# EAGLE design GPS-module (EAGLE 8.3.1)
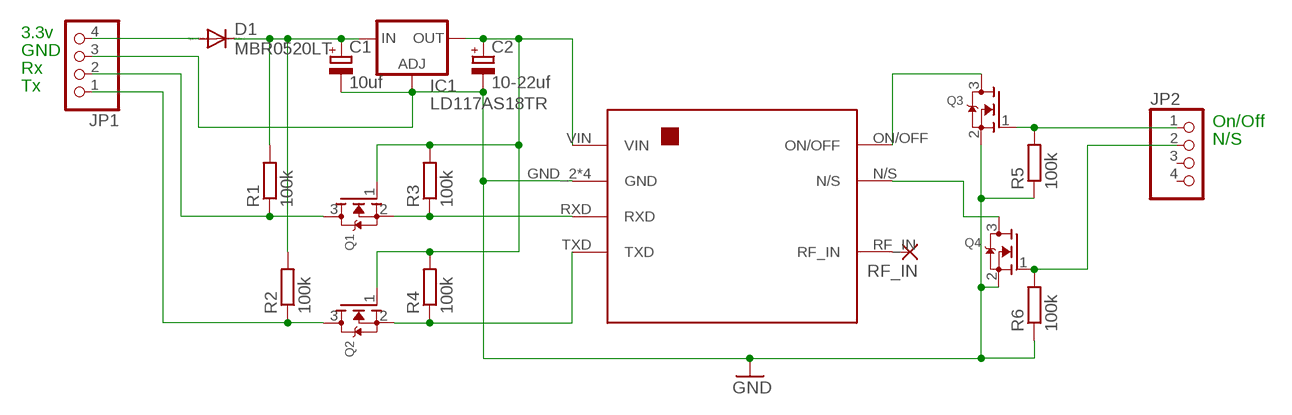
[diagram p0: schematic, sheet 1]

## Parts
C1  10uf  CPOL-EUC/6032-28R  [C/6032-28R]
C2  10-22uf  CPOL-EUC/6032-28R  [C/6032-28R]
D1  MBR0520LT  [SOD123]
IC1  LD117AS18TR  [SOT223]
JP1  PINHD-1X4  [1X04]
JP2  PINHD-1X4  [1X04]
Q1  MOSFET-NREFLOW  [SOT23]
Q2  MOSFET-NREFLOW  [SOT23]
Q3  MOSFET-NREFLOW  [SOT23]
Q4  MOSFET-NREFLOW  [SOT23]
R1  100k  R-EU_M0805  [M0805]
R2  100k  R-EU_M0805  [M0805]
R3  100k  R-EU_M0805  [M0805]
R4  100k  R-EU_M0805  [M0805]
R5  100k  R-EU_M0805  [M0805]
R6  100k  R-EU_M0805  [M0805]
RF_IN  SMD2  [SMD1,27-2,54]
U$1  GP4SF1109F2  [GP4SF1109F2]

## Nets
GND: C1.- C2.- IC1.1(ADJ) JP1.3 Q3.2(S) Q4.2(S) R5.1 R6.1 U$1.GND_2(GND) U$1.GND_5(GND) U$1.GND_6(GND) U$1.GND_8(GND)
N$1: D1.A JP1.4
N$2: C1.+ D1.C IC1.3(IN) R1.2 R2.2
N$3: C2.+ IC1.4(OUT) Q1.1(G) Q2.1(G) R3.2 R4.2 U$1.VIN
N$5: JP1.2 Q1.3(D) R1.1
N$6: JP1.1 Q2.3(D) R2.1
N$7: Q1.2(S) R3.1 U$1.RXD
N$8: Q2.2(S) R4.1 U$1.TXD
N$9: RF_IN.1(P) U$1.RF_IN
N$10: Q3.3(D) U$1.ON/OFF
N$11: JP2.1 Q3.1(G) R5.2
N$12: Q4.3(D) U$1.N/S
N$13: JP2.2 Q4.1(G) R6.2
Unconnected: JP2.3 JP2.4

## Notes on the sheet
- 3.3v
- GND
- Rx
- Tx
- On/Off
- N/S

## Library data of the parts
C1 C2 = resistor:CPOL-EU: POLARIZED CAPACITOR, European symbol
D1 = diode:MBR0520LT: SCHOTTKY BARRIER RECTIFIER Source: http://onsemi.com .. MBR0520LT1-D.pdf
IC1 = v-reg:LD117A?*: Low drop fixed and adjustable positive voltage regulators 1 A Source: http://www.st.com/stonline/products/literature/ds/7194/ld1117axx.pdf
JP1 JP2 = pinhead:PINHD-1X4: PIN HEADER
Q1-Q4 = adafruit:MOSFET-N: N-Channel Mosfet 2N7002E - 60V 260mA SOT23 [Digikey: 2N7002ET1GOSTR-ND] - REEL BSH103 - 30V 850mA SOT23 [Digikey: 568-5013-1-ND]
R1-R6 = resistor:R-EU_: RESISTOR, European symbol
RF_IN = wirepad:SMD2: SMD PAD
U$1 = mgvc:GP4SF1109F2: GPS module GP4SF1109F2

## Board
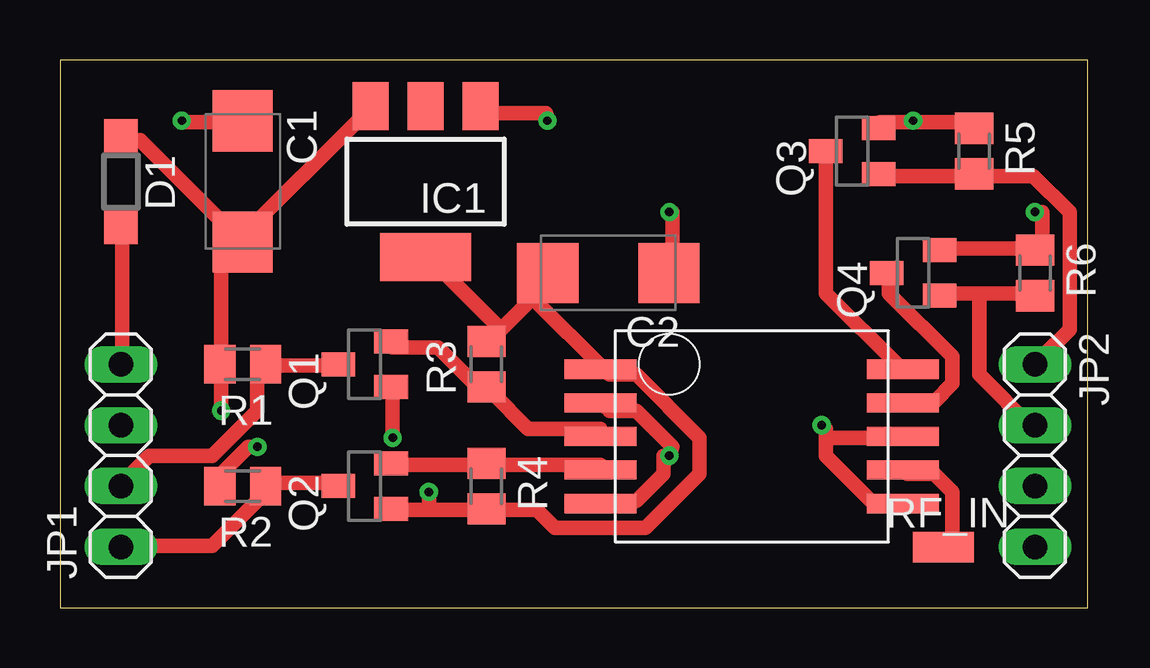
[diagram p1: board, top side]
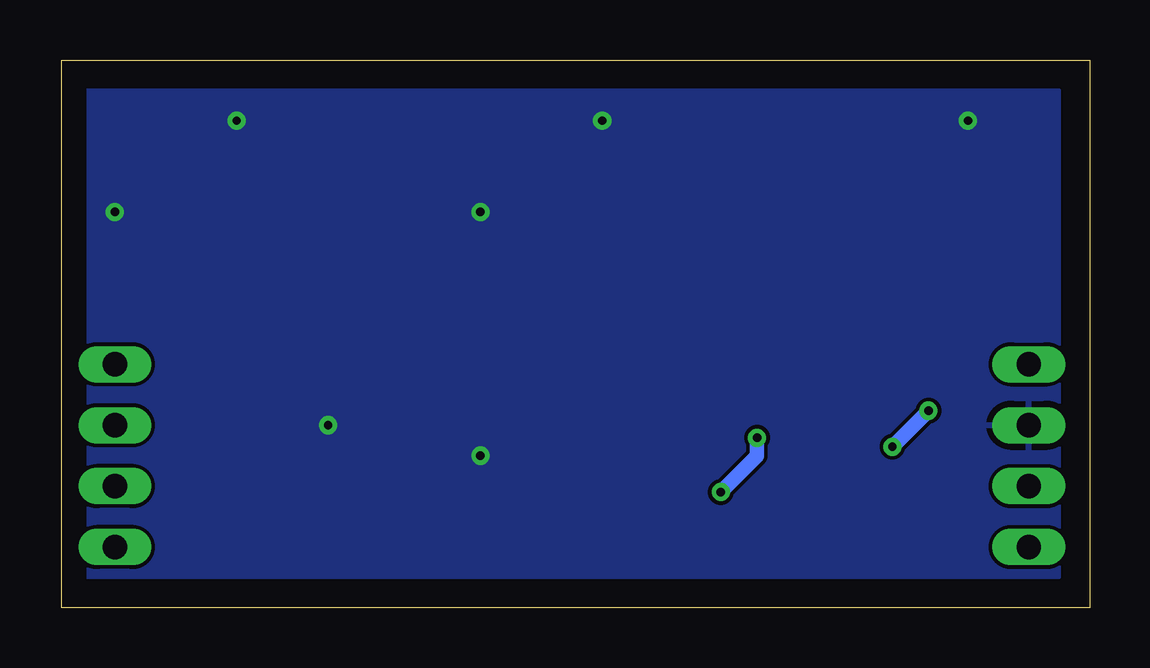
[diagram p2: board, bottom side, seen from below]

Size 42.85 x 22.85 mm. Coordinates in mm from the lower left corner, seen from the top.
Outline: 0,0 42.85,0 42.85,22.85 0,22.85 0,0
Copper layers (1*16): Top 0.035mm / dielectric 1.5mm / Bottom 0.035mm
Design rules "default *": minimum track width 0.6mm, minimum drill 0.35mm, track to track 6mil, track to pad 6mil, pad to pad 6mil, via to via 6mil, smd to smd 6mil, copper to edge 40mil, drill to drill 6mil, minimum pad ring 10mil, minimum via ring 8mil, stop-mask expansion 4mil, vias tented up to drill 0mil, thermal gap 10mil

### Footprints (pad centres in the part's own frame; a part is rotated, then mirrored left to right if it is on the bottom)
C/6032-28R = smd 2.55 x 2.5: + 2.525,0; - -2.525,0
SOD123 = smd 1.4 x 1.4: A 1.9,0; C -1.9,0
SOT223 = smd 1.5 x 2: 1 -2.3,-3.15; 2 0,-3.15; 3 2.3,-3.15 | smd 3.8 x 2: 4 0,3.15
1X04 = drill 1.016 long: 1 -3.81,0; 2 -1.27,0; 3 1.27,0; 4 3.81,0
SOT23 = smd 1 x 1.4: 1 -0.95,-1.1; 2 0.95,-1.1; 3 0,1.1
M0805 = smd 1.3 x 1.6: 1 -0.95,0; 2 0.95,0
SMD1,27-2,54 = smd 1.27 x 2.54: 1 0,0
GP4SF1109F2 = smd 3 x 0.8: GND_2 -5.4,2.2; GND_5 -5.4,-2; GND_6 7.2,-2; GND_8 7.2,0.8; N/S 7.2,2.2; ON/OFF 7.2,3.6; RF_IN 7.2,-0.6; RXD -5.4,0.8; TXD -5.4,-0.6; VIN -5.4,3.6

### Placement (x,y rotation side)
C1  7.62,17.78 270 top
C2  22.86,13.97 180 top
D1  2.54,17.78 270 top
IC1  15.24,17.78 180 top
JP1  2.54,6.35 90 top
JP2  40.64,6.35 270 top
Q1  12.7,10.16 90 top
Q2  12.7,5.08 90 top
Q3  33.02,19.05 90 top
Q4  35.56,13.97 90 top
R1  7.62,10.16 180 top
R2  7.62,5.08 180 top
R3  17.78,10.16 90 top
R4  17.78,5.08 270 top
R5  38.1,19.05 270 top
R6  40.64,13.97 270 top
RF_IN  36.83,2.54 270 top
U$1  27.94,6.35 0 top

### Tracks (layer width: path | path; a pad name or v marks a point on that pad's centre or on a via)
GND  (via drill 0.35)
  Top 0.6: Q4.2 36.82,15 40.58,15 R6.1 40.96,15 40.96,16.5 v40.64,16.51 | Q3.2 34.19,20.26 35.31,20.26 v35.56,20.32 35.69,20.26 37.95,20.26 R5.1 | IC1.1 17.63,20.64 20.27,20.64 v20.32,20.32 | C1.- 7.48,20.26 5.22,20.26 v5.08,20.32 | C2.- 25.53,14.24 25.53,16.5 v25.4,16.51 | U$1.GND_5 22.9,4.46 24.03,4.46 25.16,5.59 25.16,6.34 v25.4,6.35 25.53,6.72 24.03,8.22 22.9,8.22 U$1.GND_2 | 31.93,7.1 31.93,7.47 v31.75,7.62 | 31.93,7.1 31.93,6.34 33.81,4.46 34.94,4.46 U$1.GND_6 | 31.93,7.1 34.94,7.1 U$1.GND_8
  pour Bottom: 1.27,1.27 41.91,1.27 41.91,21.59 1.27,21.59
N$1
  Top 0.6: D1.A 2.58,15.75 2.58,10.48 JP1.4
N$2  (via drill 0.35)
  Top 0.6: v8.23,6.72 7.85,6.72 6.72,5.59 6.72,5.21 R2.2 | v6.72,8.22 6.72,10.1 R1.2 6.72,10.48 6.72,14.24 7.48,15 C1.+ 7.48,15.37 | 7.48,15.37 3.34,19.51 2.58,19.51 D1.C | 7.48,15.37 12.74,20.64 IC1.3
  Bottom 0.6: v6.72,8.22 v8.23,6.72
N$3  (via drill 0.35)
  Top 0.6: 15.38,4.09 17.63,4.09 R4.2 18.01,4.09 19.89,4.09 20.64,3.33 24.41,3.33 26.66,5.59 26.66,7.1 24.03,9.73 22.9,9.73 U$1.VIN 22.52,10.1 19.89,12.74 C2.+ 20.64,13.87 18.39,11.61 | 15.38,4.09 13.87,4.09 Q2.1 | v13.87,7.1 13.87,8.98 Q1.1 | 15.38,4.09 v15.38,4.84 | 18.39,11.61 18.01,11.23 R3.2 18.39,11.61 | 18.39,11.61 15.38,14.62 IC1.4
  Bottom 0.6: v13.87,7.1 13.87,6.34 v15.38,4.84
N$5
  Top 0.6: Q1.3 11.24,10.1 8.6,10.1 R1.1 8.23,10.1 8.23,8.22 6.35,6.34 3.71,6.34 2.58,5.21 JP1.2
N$6
  Top 0.6: Q2.3 11.24,5.21 8.6,5.21 R2.1 8.23,4.84 8.23,4.46 6.35,2.58 2.58,2.58 JP1.1
N$7
  Top 0.6: Q1.2 13.87,10.86 15.75,10.86 17.63,8.98 R3.1 18.01,8.98 19.51,7.47 22.52,7.47 U$1.RXD
N$8
  Top 0.6: Q2.2 13.87,5.97 17.63,5.97 R4.1 18.01,5.97 22.52,5.97 U$1.TXD
N$9
  Top 0.6: RF_IN.1 37.2,2.58 37.2,4.84 36.44,5.59 35.31,5.59 U$1.RF_IN
N$10
  Top 0.6: Q3.3 31.93,18.76 31.93,13.11 34.94,10.1 U$1.ON/OFF
N$11
  Top 0.6: Q3.1 34.19,18 37.95,18 R5.2 38.32,18 40.58,18 42.09,16.5 42.09,11.61 40.96,10.48 JP2.1
N$12
  Top 0.6: Q4.3 34.56,13.87 34.56,13.11 37.2,10.48 37.2,9.35 36.44,8.6 35.31,8.6 U$1.N/S
N$13
  Top 0.6: 38.32,13.11 40.58,13.11 R6.2 | 38.32,13.11 36.82,13.11 Q4.1 | 38.32,13.11 38.32,9.73 40.58,7.47 JP2.2